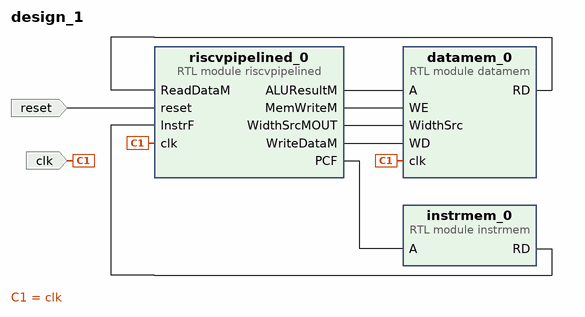
[diagram p0: block diagram of the top level]
# Vivado block design design_1, xc7z010clg400-1, Vivado 2022.2
create_bd_design design_1

create_bd_port -dir I -type rst reset
set_property -dict {CONFIG.POLARITY ACTIVE_HIGH} [get_bd_ports reset]
create_bd_port -dir I -type clk clk
set_property -dict {CONFIG.FREQ_HZ 100000000} [get_bd_ports clk]

create_bd_cell -type module -reference instrmem instrmem_0
create_bd_cell -type module -reference datamem datamem_0
create_bd_cell -type module -reference riscvpipelined riscvpipelined_0

# ---- connections ----

connect_bd_net [get_bd_ports clk] [get_bd_pins datamem_0/clk] [get_bd_pins riscvpipelined_0/clk]
connect_bd_net [get_bd_pins datamem_0/RD] [get_bd_pins riscvpipelined_0/ReadDataM]
connect_bd_net [get_bd_pins instrmem_0/RD] [get_bd_pins riscvpipelined_0/InstrF]
connect_bd_net [get_bd_ports reset] [get_bd_pins riscvpipelined_0/reset]
connect_bd_net [get_bd_pins riscvpipelined_0/ALUResultM] [get_bd_pins datamem_0/A]
connect_bd_net [get_bd_pins riscvpipelined_0/MemWriteM] [get_bd_pins datamem_0/WE]
connect_bd_net [get_bd_pins riscvpipelined_0/PCF] [get_bd_pins instrmem_0/A]
connect_bd_net [get_bd_pins riscvpipelined_0/WidthSrcMOUT] [get_bd_pins datamem_0/WidthSrc]
connect_bd_net [get_bd_pins riscvpipelined_0/WriteDataM] [get_bd_pins datamem_0/WD]

validate_bd_design
save_bd_design
